# Altium schematic sheet MCU - Power and I_O.SchDoc: [7] MCU - Power
size A4; ApprovedBy: Nagy Richard; CheckedBy: Nagy Richard; Author: Nagy Richard; CompanyName: EmbedCore; DrawnBy: Nagy Richard; Engineer: Nagy Richard; Organization: EmbedCore; Revision: 1.0; SheetNumber: 7; SheetTotal: 25
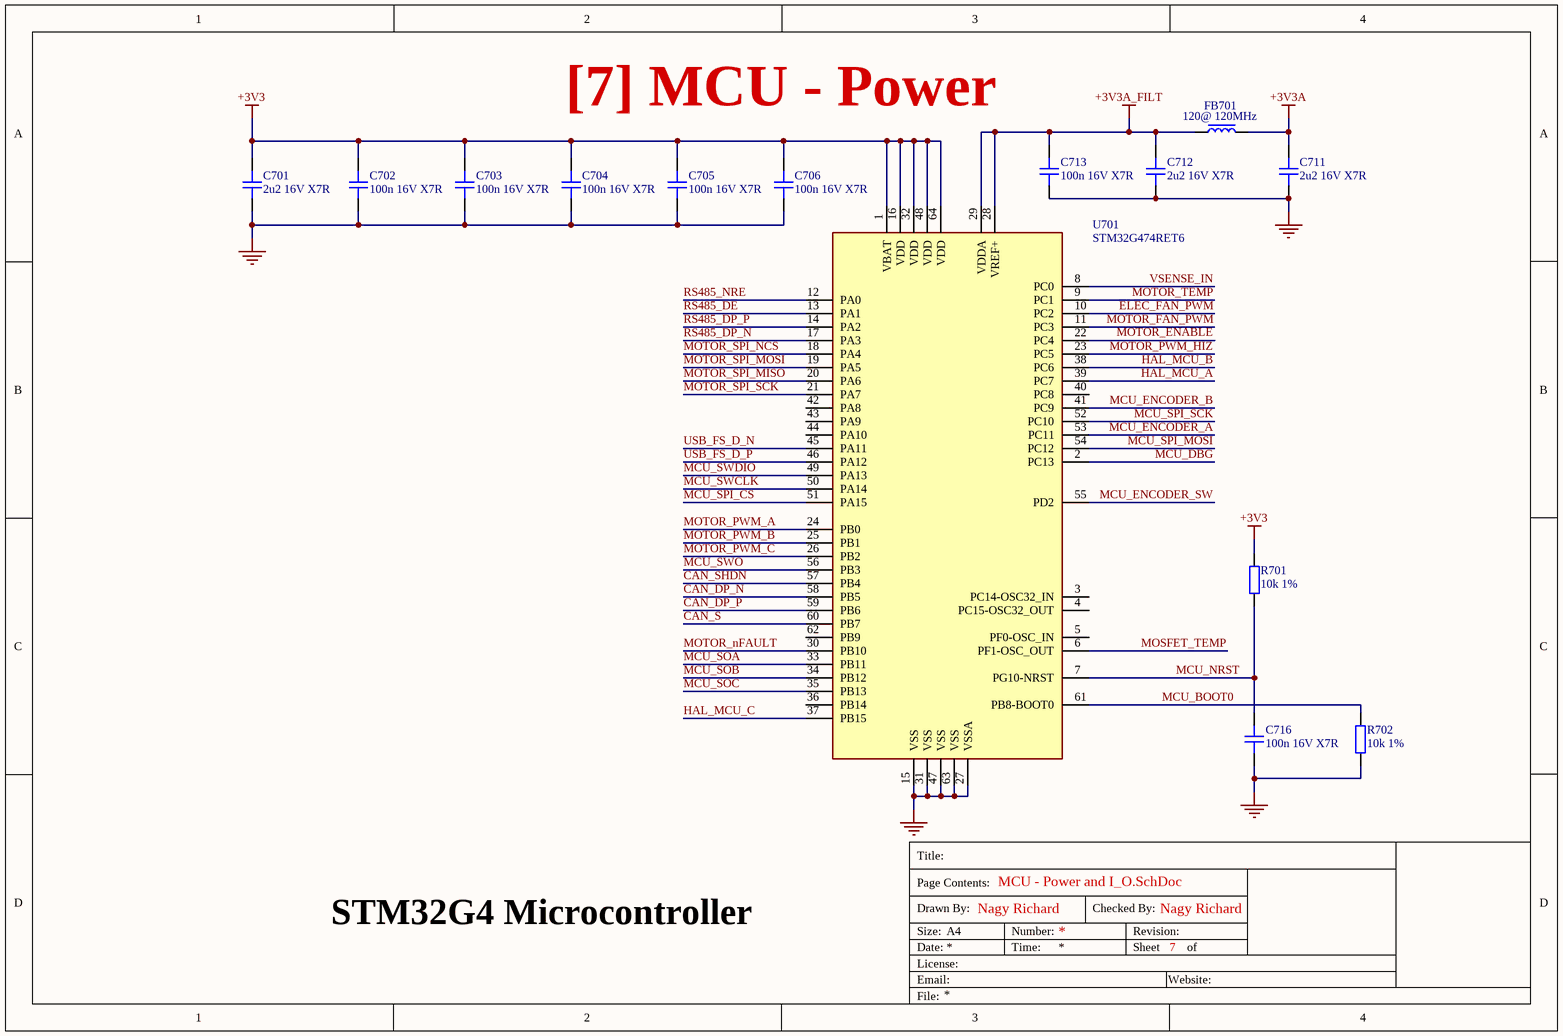
[diagram p0: MCU - Power and I_O.SchDoc]

## Parts
C701  2u2 16V X7R  [CAP_0603]
C702  100n 16V X7R  [CAP_0402]
C703  100n 16V X7R  [CAP_0402]
C704  100n 16V X7R  [CAP_0402]
C705  100n 16V X7R  [CAP_0402]
C706  100n 16V X7R  [CAP_0402]
C711  2u2 16V X7R  [CAP_0603]
C712  2u2 16V X7R  [CAP_0603]
C713  100n 16V X7R  [CAP_0402]
C716  100n 16V X7R  [CAP_0402]
FB701  120@ 120MHz  [FB_0603]
R701  10k 1%  [RES_0402]
R702  10k 1%  [RES_0402]
U701  STM32G474RET6  [QFP50P1200X1200X160-64N]

## Nets
+3V3: C701.2 C702.2 C703.2 C704.2 C705.2 C706.2 R701.2 U701.1(VBAT) U701.16(VDD) U701.32(VDD) U701.48(VDD) U701.64(VDD)
+3V3A: C711.2 FB701.2
+3V3A_FILT: C712.2 C713.2 FB701.1 U701.28(VREF+) U701.29(VDDA)
GND: C701.1 C702.1 C703.1 C704.1 C705.1 C706.1 C711.1 C712.1 C713.1 C716.1 R702.1 U701.15(VSS) U701.27(VSSA) U701.31(VSS) U701.47(VSS) U701.63(VSS)
CAN_DP_N: U701.58(PB5)
CAN_DP_P: U701.59(PB6)
CAN_S: U701.60(PB7)
CAN_SHDN: U701.57(PB4)
ELEC_FAN_PWM: U701.10(PC2)
HAL_MCU_A: U701.39(PC7)
HAL_MCU_B: U701.38(PC6)
HAL_MCU_C: U701.37(PB15)
MCU_BOOT0: R702.2 U701.61(PB8-BOOT0)
MCU_DBG: U701.2(PC13)
MCU_ENCODER_A: U701.53(PC11)
MCU_ENCODER_B: U701.41(PC9)
MCU_ENCODER_SW: U701.55(PD2)
MCU_NRST: C716.2 R701.1 U701.7(PG10-NRST)
MCU_SOA: U701.33(PB11)
MCU_SOB: U701.34(PB12)
MCU_SOC: U701.35(PB13)
MCU_SPI_CS: U701.51(PA15)
MCU_SPI_MOSI: U701.54(PC12)
MCU_SPI_SCK: U701.52(PC10)
MCU_SWCLK: U701.50(PA14)
MCU_SWDIO: U701.49(PA13)
MCU_SWO: U701.56(PB3)
MOSFET_TEMP: U701.6(PF1-OSC_OUT)
MOTOR_ENABLE: U701.22(PC4)
MOTOR_FAN_PWM: U701.11(PC3)
MOTOR_nFAULT: U701.30(PB10)
MOTOR_PWM_A: U701.24(PB0)
MOTOR_PWM_B: U701.25(PB1)
MOTOR_PWM_C: U701.26(PB2)
MOTOR_PWM_HIZ: U701.23(PC5)
MOTOR_SPI_MISO: U701.20(PA6)
MOTOR_SPI_MOSI: U701.19(PA5)
MOTOR_SPI_NCS: U701.18(PA4)
MOTOR_SPI_SCK: U701.21(PA7)
MOTOR_TEMP: U701.9(PC1)
RS485_DE: U701.13(PA1)
RS485_DP_N: U701.17(PA3)
RS485_DP_P: U701.14(PA2)
RS485_NRE: U701.12(PA0)
USB_FS_D_N: U701.45(PA11)
USB_FS_D_P: U701.46(PA12)
VSENSE_IN: U701.8(PC0)

Not connected (* = marked no-connect by the designer): U701 3(PC14-OSC32_IN) 4(PC15-OSC32_OUT) 5(PF0-OSC_IN) 36(PB14) 40(PC8) 42(PA8) 43(PA9) 44(PA10) 62(PB9)

## Notes on the sheet
- STM32G4 Microcontroller
- Title:
- Drawn By:
- Page Contents:
- Checked By:
- Size:
- Date:
- File:
- License:
- Email:
- A4
- Number:
- Time:
- Revision:
- Sheet
- Website:
- of

## Library data of the parts
C701 C711 C712 = CAP_0603: Capacitor SMD 0603; Manufacturer: YAGEO; Manufacturer Part Number: CC0603KRX7R7BB225; Distributor Link: www.lcsc.com; LCSC: C914769; Rating: *; Dielectric: *
C702-C706 C713 C716 = CAP_0402: Capacitor SMD 0402; Manufacturer: YAGEO; Manufacturer Part Number: CC0402JRX7R7BB104; Distributor Link: www.lcsc.com; LCSC: C541464; Rating: *; Dielectric: *
FB701 = FB_0603: Ferrite Bead SMD 0603; Manufacturer: TDK; Manufacturer Part Number: MMZ1608S121ATD25; Distributor Link: www.lcsc.com; LCSC: C2661467
R701 R702 = RES_0402: Resistor SMD 0402; Manufacturer: PANASONIC; Manufacturer Part Number: ERJPA2F1002X; Distributor Link: www.lcsc.com; LCSC: C427247
U701 = STM32G474RET6: ARM Microcontrollers - MCU Mainstream Arm Cortex-M4 MCU 170 MHz 512 Kbytes of Flash Math Accel, HR Timer, H; Manufacturer: *; Manufacturer Part Number: *; LCSC: *